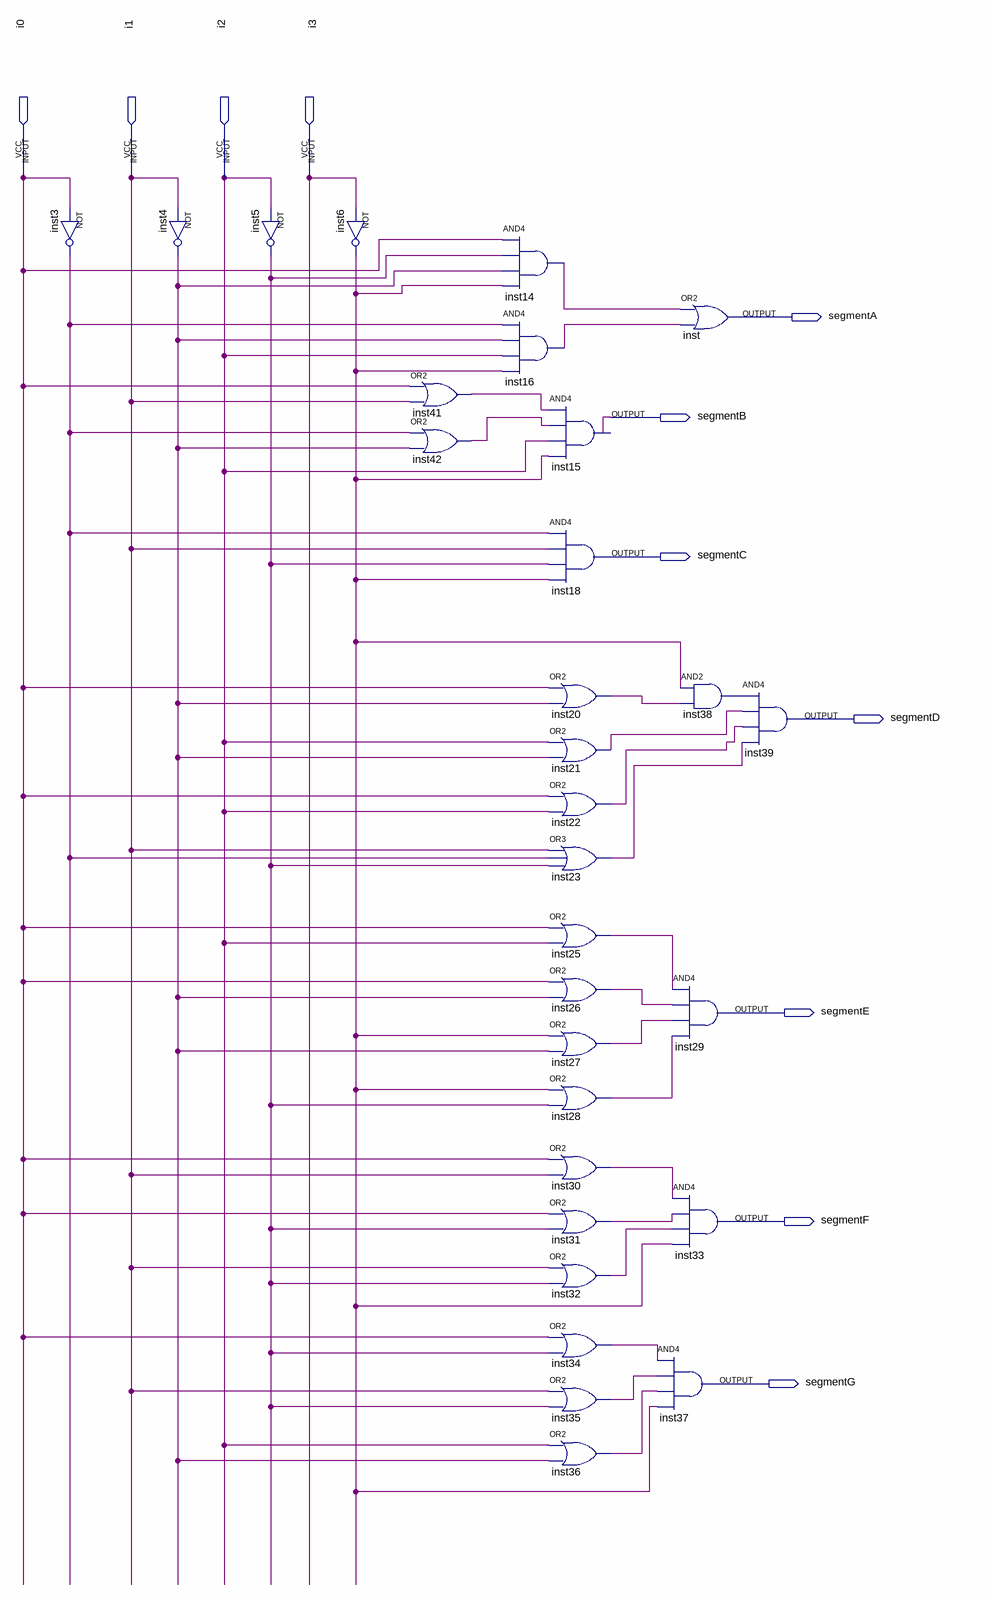
[diagram p0: schematic sheet]
// Quartus schematic display7.bdf as structural Verilog: 30 symbols, 11 pins
module display7 (
  input  i0,
  input  i1,
  input  i2,
  input  i3,
  output segmentA,
  output segmentB,
  output segmentC,
  output segmentD,
  output segmentE,
  output segmentF,
  output segmentG
);

  wire inst3_out, inst4_out, inst5_out, inst6_out, inst14_out, inst16_out, inst20_out, inst21_out,
       inst22_out, inst23_out, inst25_out, inst26_out, inst27_out, inst28_out, inst30_out, inst31_out,
       inst32_out, inst34_out, inst35_out, inst36_out, inst38_out, inst41_out, inst42_out;

  not inst3 (inst3_out, i0);
  not inst4 (inst4_out, i1);
  not inst5 (inst5_out, i2);
  not inst6 (inst6_out, i3);
  or inst41 (inst41_out, i0, i1);
  or inst42 (inst42_out, inst3_out, inst4_out);
  and inst14 (inst14_out, i0, inst5_out, inst4_out, inst6_out);
  and inst16 (inst16_out, inst3_out, inst4_out, i2, inst6_out);
  and inst15 (segmentB, inst41_out, inst42_out, i2, inst6_out);
  and inst18 (segmentC, inst3_out, i1, inst5_out, inst6_out);
  or inst20 (inst20_out, i0, inst4_out);
  or inst21 (inst21_out, i2, inst4_out);
  or inst22 (inst22_out, i0, i2);
  or inst23 (inst23_out, i1, inst3_out, inst5_out);
  or inst25 (inst25_out, i0, i2);
  or inst26 (inst26_out, i0, inst4_out);
  or inst27 (inst27_out, inst6_out, inst4_out);
  or inst28 (inst28_out, inst6_out, inst5_out);
  or inst30 (inst30_out, i0, i1);
  or inst31 (inst31_out, i0, inst5_out);
  or inst32 (inst32_out, i1, inst5_out);
  or inst34 (inst34_out, i0, inst5_out);
  or inst35 (inst35_out, i1, inst5_out);
  or inst36 (inst36_out, i2, inst4_out);
  or inst (segmentA, inst14_out, inst16_out);
  and inst38 (inst38_out, inst6_out, inst20_out);
  and inst29 (segmentE, inst25_out, inst26_out, inst27_out, inst28_out);
  and inst33 (segmentF, inst30_out, inst31_out, inst32_out, inst6_out);
  and inst37 (segmentG, inst34_out, inst35_out, inst36_out, inst6_out);
  and inst39 (segmentD, inst38_out, inst21_out, inst22_out, inst23_out);
endmodule
